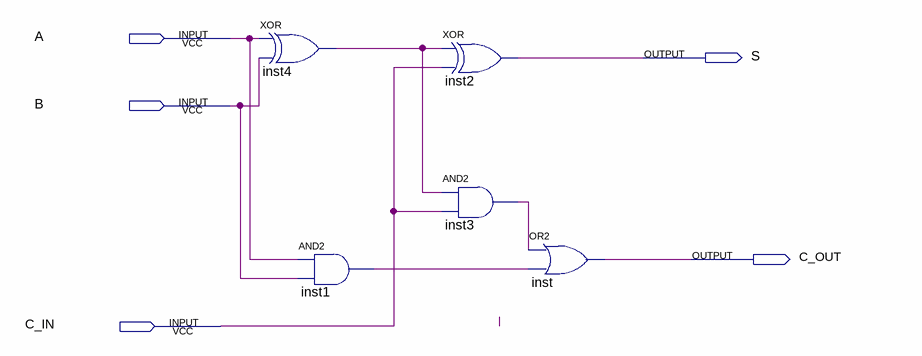
[diagram p0: schematic sheet]
// Quartus schematic full_adder.bdf as structural Verilog: 5 symbols, 5 pins
module full_adder (
  input  A,
  input  B,
  input  C_IN,
  output S,
  output C_OUT
);

  wire inst1_out, inst3_out, inst4_out;

  xor inst4 (inst4_out, A, B);
  and inst1 (inst1_out, A, B);
  xor inst2 (S, inst4_out, C_IN);
  and inst3 (inst3_out, inst4_out, C_IN);
  or inst (C_OUT, inst3_out, inst1_out);
endmodule
